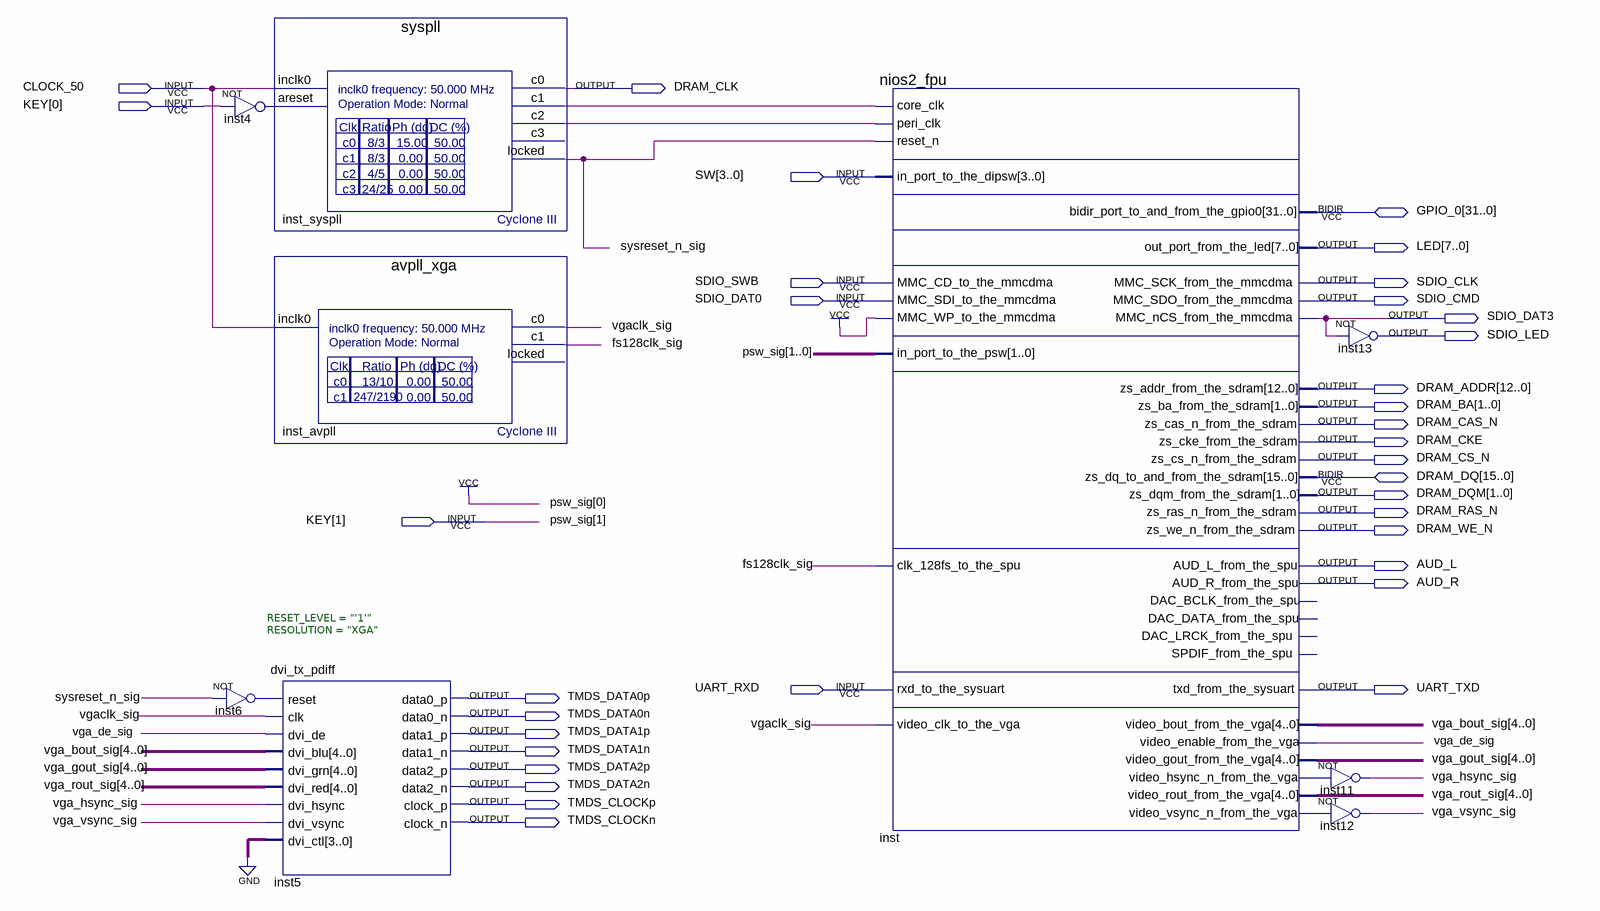
[diagram p0: schematic sheet]
// Quartus schematic cineraria.bdf as structural Verilog: 9 symbols, 34 pins
module cineraria (
  input  CLOCK_50,
  input  [1:0] KEY,
  input  [3:0] SW,
  input  SDIO_SWB,
  input  SDIO_DAT0,
  input  UART_RXD,
  inout  [31:0] GPIO_0,
  inout  [15:0] DRAM_DQ,
  output DRAM_CLK,
  output [7:0] LED,
  output SDIO_CLK,
  output SDIO_CMD,
  output SDIO_DAT3,
  output SDIO_LED,
  output [12:0] DRAM_ADDR,
  output [1:0] DRAM_BA,
  output DRAM_CAS_N,
  output DRAM_CKE,
  output DRAM_CS_N,
  output [1:0] DRAM_DQM,
  output DRAM_RAS_N,
  output DRAM_WE_N,
  output AUD_L,
  output AUD_R,
  output UART_TXD,
  output TMDS_DATA0p,
  output TMDS_DATA0n,
  output TMDS_DATA1p,
  output TMDS_DATA1n,
  output TMDS_DATA2p,
  output TMDS_DATA2n,
  output TMDS_CLOCKp,
  output TMDS_CLOCKn
);

  wire fs128clk_sig, inst4_out, inst6_out, inst_syspll_c1, inst_syspll_c2, inst_video_hsync_n_from_the_vga,
       inst_video_vsync_n_from_the_vga, sysreset_n_sig, vga_de_sig, vga_hsync_sig, vga_vsync_sig, vgaclk_sig;
  wire [4:0] vga_bout_sig, vga_gout_sig, vga_rout_sig;

  not inst4 (inst4_out, KEY[0]);
  not inst6 (inst6_out, sysreset_n_sig);
  syspll inst_syspll (
    .inclk0(CLOCK_50), .areset(inst4_out), .c0(DRAM_CLK), .c1(inst_syspll_c1), .c2(inst_syspll_c2),
    .locked(sysreset_n_sig));  // open: c3
  avpll_xga inst_avpll (.inclk0(CLOCK_50), .c0(vgaclk_sig), .c1(fs128clk_sig));  // open: locked
  dvi_tx_pdiff #(.RESET_LEVEL("'1'"), .RESOLUTION("XGA")) inst5 (
    .reset(inst6_out), .clk(vgaclk_sig), .dvi_de(vga_de_sig), .dvi_blu(vga_bout_sig), .dvi_grn(vga_gout_sig),
    .dvi_red(vga_rout_sig), .dvi_hsync(vga_hsync_sig), .dvi_vsync(vga_vsync_sig), .dvi_ctl(4'b0000),
    .data0_p(TMDS_DATA0p), .data0_n(TMDS_DATA0n), .data1_p(TMDS_DATA1p), .data1_n(TMDS_DATA1n),
    .data2_p(TMDS_DATA2p), .data2_n(TMDS_DATA2n), .clock_p(TMDS_CLOCKp), .clock_n(TMDS_CLOCKn));
  nios2_fpu inst (
    .core_clk(inst_syspll_c1), .peri_clk(inst_syspll_c2), .reset_n(sysreset_n_sig),
    .in_port_to_the_dipsw(SW), .MMC_CD_to_the_mmcdma(SDIO_SWB), .MMC_SDI_to_the_mmcdma(SDIO_DAT0),
    .MMC_WP_to_the_mmcdma(1'b1), .in_port_to_the_psw({KEY[1], 1'b1}), .clk_128fs_to_the_spu(fs128clk_sig),
    .rxd_to_the_sysuart(UART_RXD), .video_clk_to_the_vga(vgaclk_sig), .out_port_from_the_led(LED),
    .MMC_SCK_from_the_mmcdma(SDIO_CLK), .MMC_SDO_from_the_mmcdma(SDIO_CMD),
    .MMC_nCS_from_the_mmcdma(SDIO_DAT3), .zs_addr_from_the_sdram(DRAM_ADDR), .zs_ba_from_the_sdram(DRAM_BA),
    .zs_cas_n_from_the_sdram(DRAM_CAS_N), .zs_cke_from_the_sdram(DRAM_CKE),
    .zs_cs_n_from_the_sdram(DRAM_CS_N), .zs_dqm_from_the_sdram(DRAM_DQM),
    .zs_ras_n_from_the_sdram(DRAM_RAS_N), .zs_we_n_from_the_sdram(DRAM_WE_N), .AUD_L_from_the_spu(AUD_L),
    .AUD_R_from_the_spu(AUD_R), .txd_from_the_sysuart(UART_TXD), .video_bout_from_the_vga(vga_bout_sig),
    .video_enable_from_the_vga(vga_de_sig), .video_gout_from_the_vga(vga_gout_sig),
    .video_hsync_n_from_the_vga(inst_video_hsync_n_from_the_vga), .video_rout_from_the_vga(vga_rout_sig),
    .video_vsync_n_from_the_vga(inst_video_vsync_n_from_the_vga), .bidir_port_to_and_from_the_gpio0(GPIO_0),
    .zs_dq_to_and_from_the_sdram(DRAM_DQ));  // open: DAC_BCLK_from_the_spu, DAC_DATA_from_the_spu, DAC_LRCK_from_the_spu, SPDIF_from_the_spu
  not inst13 (SDIO_LED, SDIO_DAT3);
  not inst11 (vga_hsync_sig, inst_video_hsync_n_from_the_vga);
  not inst12 (vga_vsync_sig, inst_video_vsync_n_from_the_vga);

  // Other names for the same wires on the sheet: psw_sig[1] = KEY[1]
endmodule
